# Altium project Power&Measurement_V2.PrjPcb
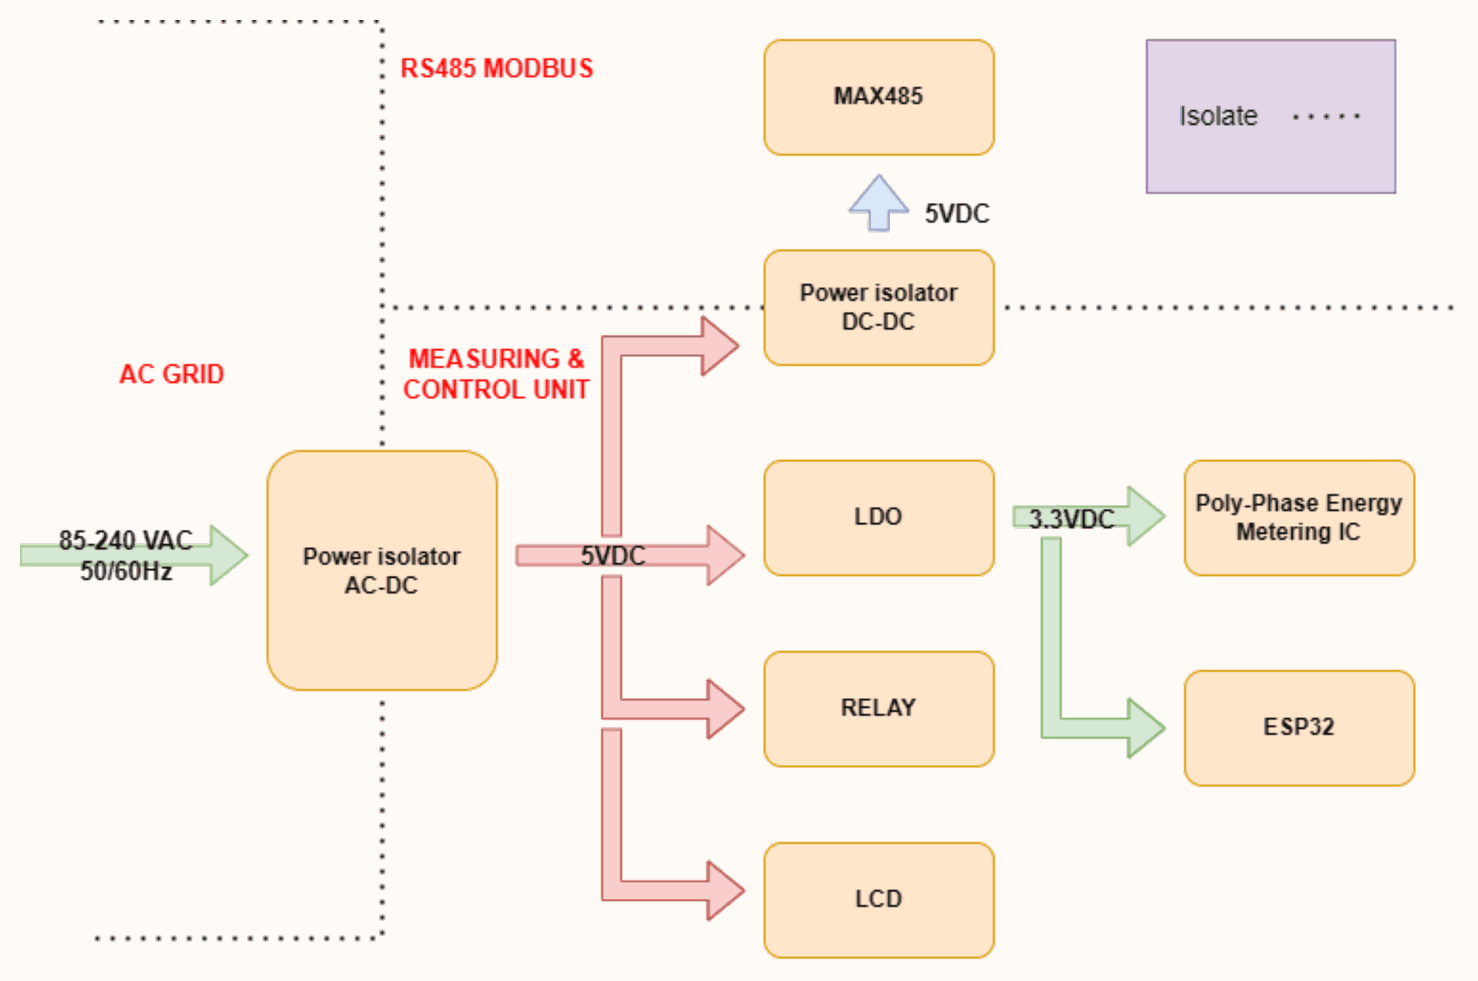
[diagram p0: Sheet1.SchDoc]
DrawnBy: Hoang Nhat; MasterProject: POWER METER V2; SubSystem: Power & Measurement
3 sheets, 128 parts. Net scope: flat (ports and power ports of the same name join across sheets).
Board file: PCB1.PcbDoc
Sheets:
  Sheet1.SchDoc
  Sheet2.SchDoc
  Sheet3.SchDoc

## Sheet Sheet1.SchDoc: Power Tree
size 420 x 297 mm; SheetNumber: 1; SheetTotal: 3

### Notes on the sheet
- Sub-system:
- Project:
- Design by:
- Sheet title:
- Sheet
- of
- Checked by:
- Approved by:
- Doc No:
- Revision:
- Size:
- Date:
- A3

## Sheet Sheet2.SchDoc: Power supply & Other function
size 420 x 297 mm; SheetNumber: 2; SheetTotal: 3
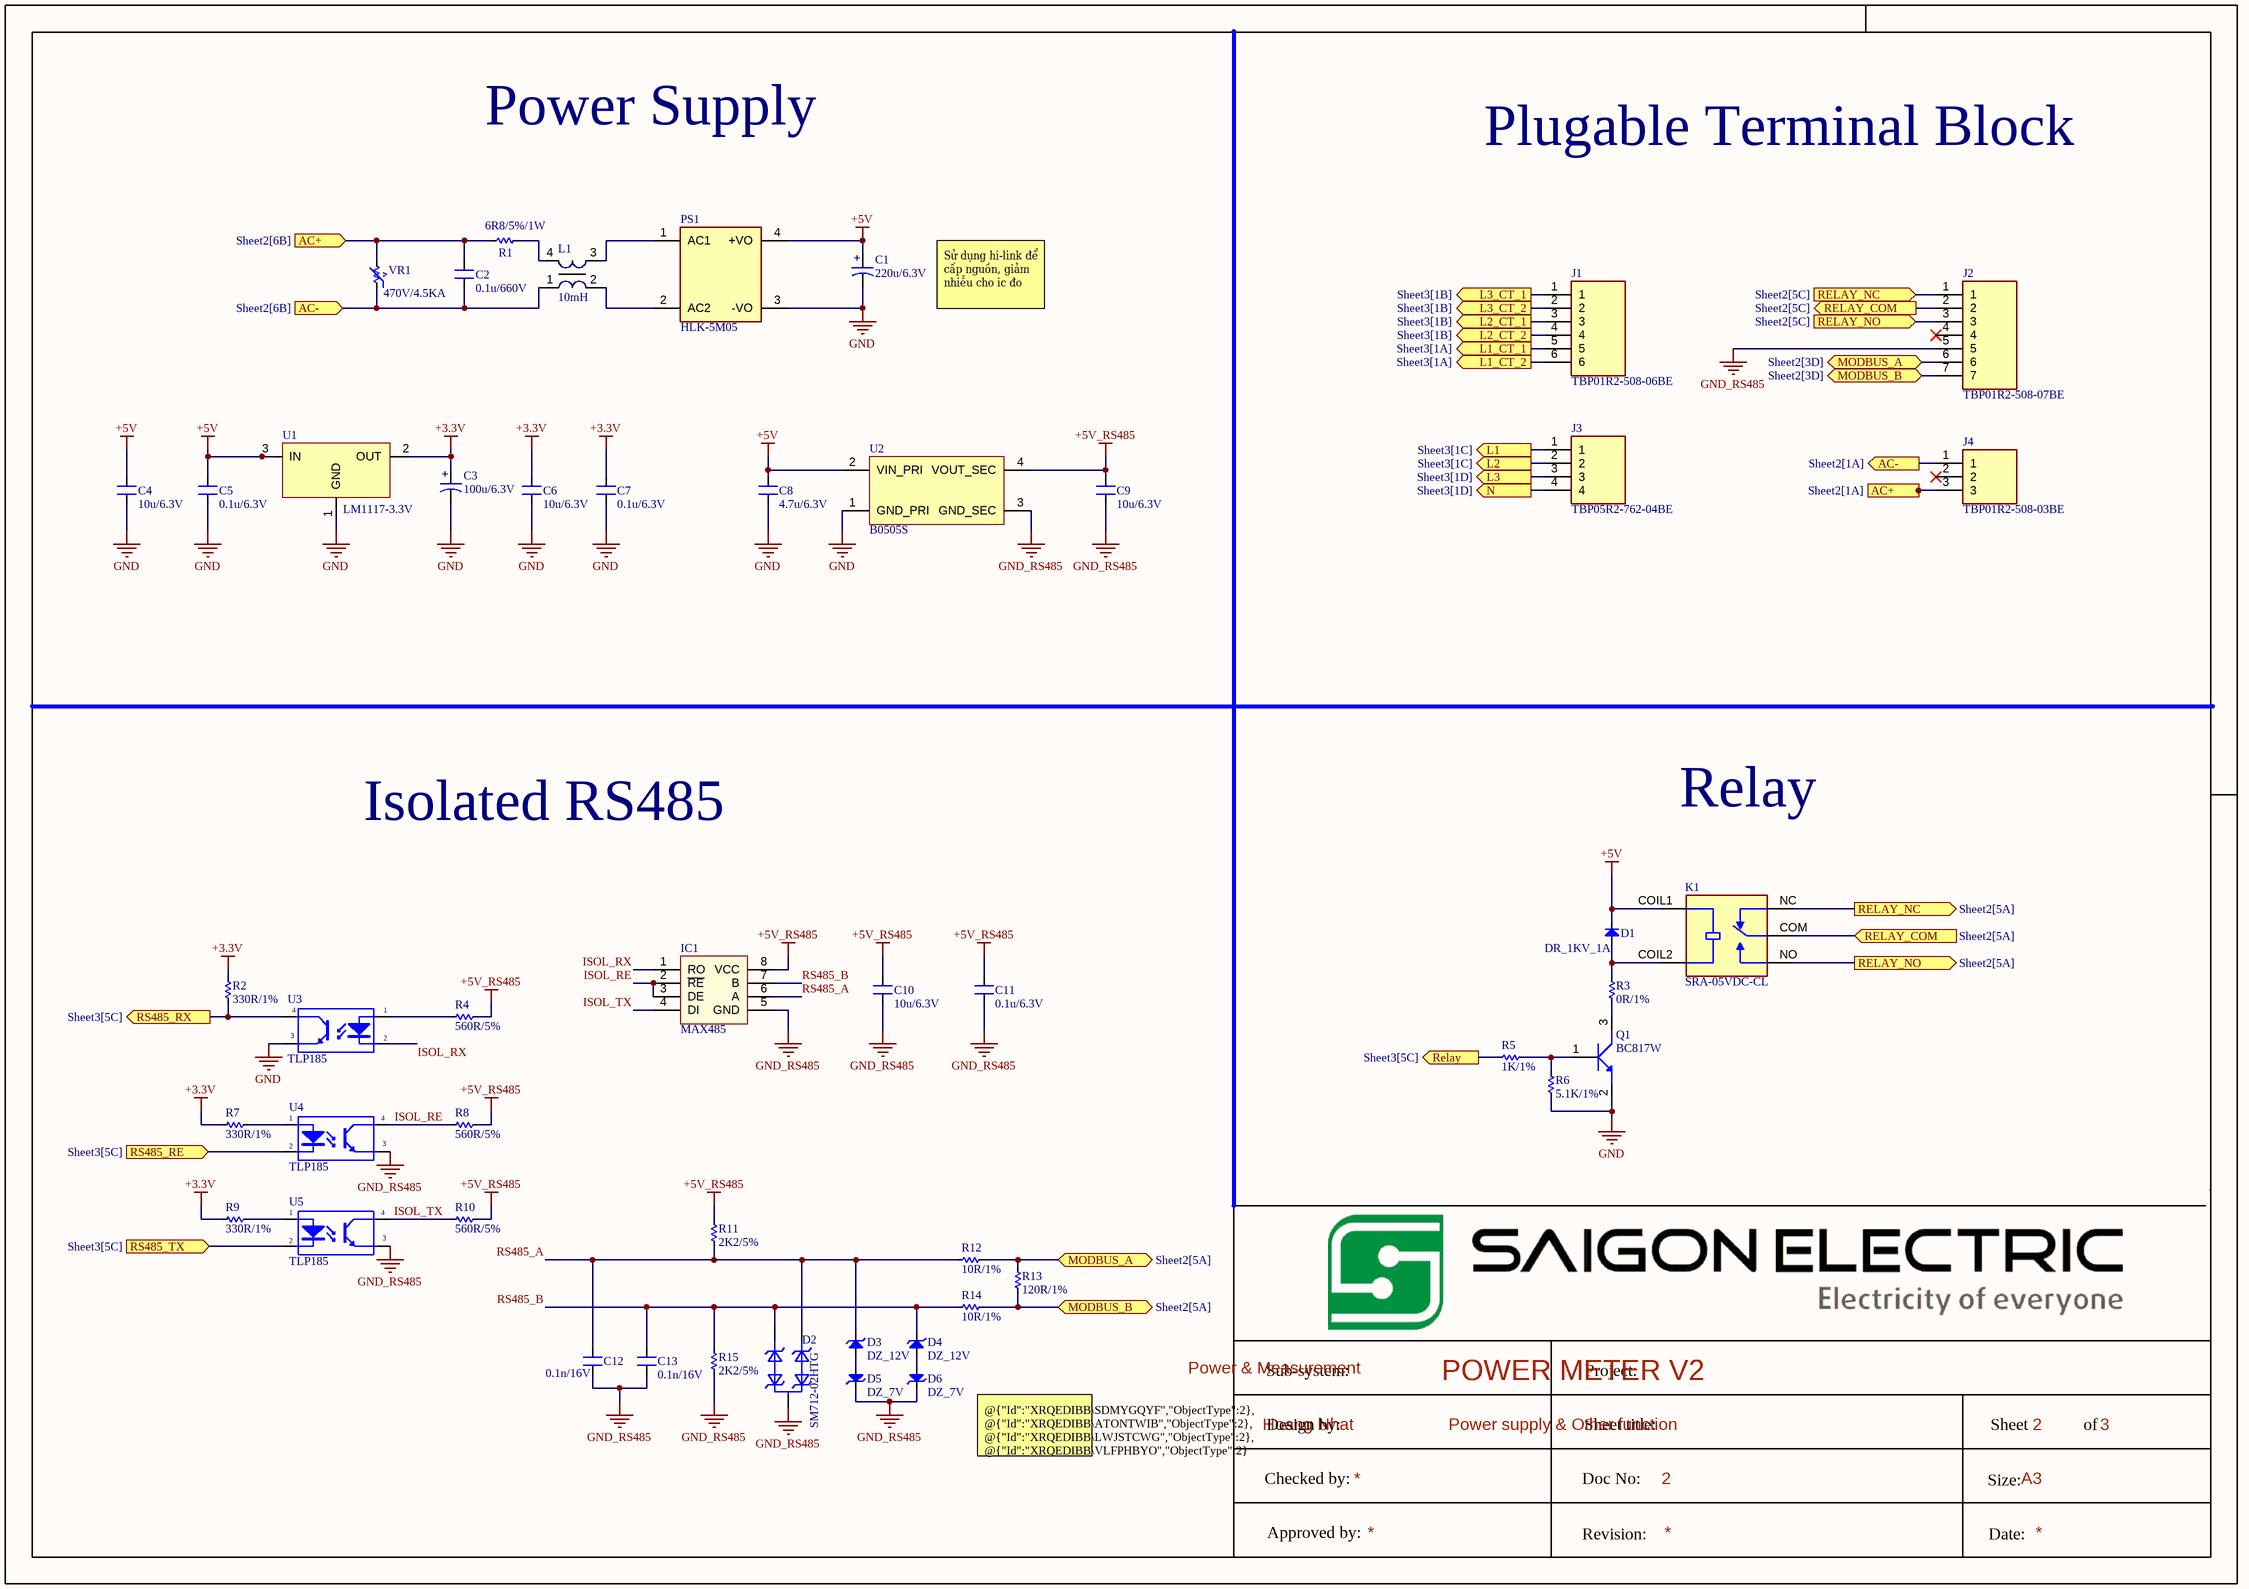
[diagram p1: Sheet2.SchDoc]

### Parts
C1  220u/6.3V  [CAP-ALU-SMD-6.3x7.7x2.2]
C2  0.1u/660V  [CAPRR1500W60L1750T900H1600]
C3  100u/6.3V  [CAP-ALU-SMD-6.3x7.7x2.2]
C4  10u/6.3V  [CAP_C_2012X110]
C5  0.1u/6.3V  [CAP_C_2012X110]
C6  10u/6.3V  [CAP_C_2012X110]
C7  0.1u/6.3V  [CAP_C_2012X110]
C8  4.7u/6.3V  [CAP_C_2012X110]
C9  10u/6.3V  [CAP_C_2012X110]
C10  10u/6.3V  [CAP_C_2012X110]
C11  0.1u/6.3V  [CAP_C_2012X110]
C12  0.1n/16V  [CAP_C_2012X110]
C13  0.1n/16V  [CAP_C_2012X110]
D1  DR_1KV_1A  [DIOM5025X26N]
D2  SM712-02HTG  [SOT95P237X112-3N]
D3  DZ_12V  [LL-34]
D4  DZ_12V  [LL-34]
D5  DZ_7V  [LL-34]
D6  DZ_7V  [LL-34]
IC1  MAX485  [SOIC-8]
J1  TBP01R2-508-06BE  [CUI_TBP01R2-508-06BE]
J2  TBP01R2-508-07BE  [CUI_TBP01R2-508-07BE]
J3  TBP05R2-762-04BE  [CUI_TBP05R2-762-04BE]
J4  TBP01R2-508-03BE  [CUI_TBP01R2-508-03BE]
K1  SRA-05VDC-CL  [RELAY_SRA-05VDC-CL]
L1  10mH  [UU98LFH142LF]
PS1  HLK-5M05  [CONV_HLK-5M05]
Q1  BC817W  [SOT-323]
R1  6R8/5%/1W  [RES-1W]
R2  330R/1%  [RES_C_2012X65]
R3  0R/1%  [RES_C_2012X65]
R4  560R/5%  [RES_C_2012X65]
R5  1K/1%  [RES_C_2012X65]
R6  5.1K/1%  [RES_C_2012X65]
R7  330R/1%  [RES_C_2012X65]
R8  560R/5%  [RES_C_2012X65]
R9  330R/1%  [RES_C_2012X65]
R10  560R/5%  [RES_C_2012X65]
R11  2K2/5%  [RES_C_2012X65]
R12  10R/1%  [RES_C_3216X70]
R13  120R/1%  [RES_C_3216X70]
R14  10R/1%  [RES_C_3216X70]
R15  2K2/5%  [RES_C_2012X65]
U1  LM1117-3.3V  [SOT230P700X180-4N]
U2  B0505S  [B0505S-1W]
U3  TLP185  [SOP254P700X220-4N]
U4  TLP185  [SOP254P700X220-4N]
U5  TLP185  [SOP254P700X220-4N]
VR1  470V/4.5KA  [B72214P2301K101]

### Ports
AC+ (in, see Sheet2[6B]), AC+ (out, see Sheet2[1A]), AC- (in, see Sheet2[6B]), AC- (out, see Sheet2[1A]), L1 (out, see Sheet3[1C]), L1_CT_1 (out, see Sheet3[1A]), L1_CT_2 (out, see Sheet3[1A]), L2 (out, see Sheet3[1C]), L2_CT_1 (out, see Sheet3[1B]), L2_CT_2 (out, see Sheet3[1B]), L3 (out, see Sheet3[1D]), L3_CT_1 (out, see Sheet3[1B]), L3_CT_2 (out, see Sheet3[1B]), MODBUS_A (bidir, see Sheet2[3D]), MODBUS_A (bidir, see Sheet2[5A]), MODBUS_B (bidir, see Sheet2[3D]), MODBUS_B (bidir, see Sheet2[5A]), N (out, see Sheet3[1D]), Relay (out, see Sheet3[5C]), RELAY_COM (in, see Sheet2[5A]), RELAY_COM (out, see Sheet2[5C]), RELAY_NC (in, see Sheet2[5C]), RELAY_NC (out, see Sheet2[5A]), RELAY_NO (in, see Sheet2[5C]), RELAY_NO (out, see Sheet2[5A]), RS485_RE (in, see Sheet3[5C]), RS485_RX (out, see Sheet3[5C]), RS485_TX (in, see Sheet3[5C])

### Nets
+3.3V: C3.1 C6.2 C7.2 R2.1 R7.1 R9.1 U1.2(OUT)
+5V: C1.1 C4.2 C5.2 C8.2 D1.2(K) K1.COIL1 PS1.4(+VO) U1.3(IN) U2.2(VIN_PRI)
+5V_RS485: C9.2 C10.2 C11.2 IC1.8(VCC) R4.2 R8.2 R10.2 R11.2 U2.4(VOUT_SEC)
GND: C1.2 C3.2 C4.1 C5.1 C6.1 C7.1 C8.1 PS1.3(-VO) Q1.2(E) R6.1 U1.1(GND) U2.1(GND_PRI) U3.3(E)
GND_RS485: C9.1 C10.1 C11.1 C12.1 C13.1 D2.3 D5.1(K) D6.1(K) IC1.5(GND) J2.5 R15.1 U2.3(GND_SEC) U4.3(E) U5.3(E)
ISOL_RE: IC1.2(~{RE}) IC1.3(DE) R8.1 U4.4(C)
ISOL_RX: IC1.1(RO) U3.2(K)
ISOL_TX: IC1.4(DI) R10.1 U5.4(C)
RS485_A: C12.2 D2.1 D3.1(K) IC1.6(A) R11.1 R12.1
RS485_B: C13.2 D2.2 D4.1(K) IC1.7(B) R14.1 R15.2
NetC2_1: C2.1 J4.1 L1.1 VR1.2 ; port AC-
NetC2_2: C2.2 J4.3 R1.1 VR1.1 ; port AC+
NetCT1_1: J1.6 ; port L1_CT_2
NetCT1_2: J1.5 ; port L1_CT_1
NetCT2_1: J1.4 ; port L2_CT_2
NetCT2_2: J1.3 ; port L2_CT_1
NetCT3_1: J1.2 ; port L3_CT_2
NetCT3_2: J1.1 ; port L3_CT_1
NetD1_1: D1.1(A) K1.COIL2 R3.2
NetD3_2: D3.2(A) D5.2(A)
NetD4_2: D4.2(A) D6.2(A)
NetF1_1: J3.4 ; port N
NetJ2_1: J2.1 K1.NC ; port RELAY_NC
NetJ2_2: J2.2 K1.COM ; port RELAY_COM
NetJ2_3: J2.3 K1.NO ; port RELAY_NO
NetJ2_6: J2.6 R12.2 R13.2 ; port MODBUS_A
NetJ2_7: J2.7 R13.1 R14.2 ; port MODBUS_B
NetJ3_1: J3.1 ; port L1
NetJ3_2: J3.2 ; port L2
NetJ3_3: J3.3 ; port L3
NetJ6_2: U5.2(K) ; port RS485_TX
NetJ6_4: U4.2(K) ; port RS485_RE
NetJ6_8: R2.2 U3.4(C) ; port RS485_RX
NetJ6_10: R5.1 ; port Relay
NetL1_2: L1.2 PS1.2(AC2)
NetL1_3: L1.3 PS1.1(AC1)
NetL1_4: L1.4 R1.2
NetQ1_1: Q1.1(B) R5.2 R6.2
NetQ1_3: Q1.3(C) R3.1
NetR4_1: R4.1 U3.1(A)
NetR7_2: R7.2 U4.1(A)
NetR9_2: R9.2 U5.1(A)

Not connected (* = marked no-connect by the designer): J2 4*; J4 2*

### Notes on the sheet
- Power Supply
- Plugable Terminal Block
- Sử dụng hi-link để cấp nguồn, giảm nhiễu cho ic đo
- Isolated RS485
- Relay
- @{"Id":"XRQEDIBB\SDMYGQYF","ObjectType":2}, @{"Id":"XRQEDIBB\ATONTWIB","ObjectType":2}, @{"Id":"XRQEDIBB\LWJSTCWG","ObjectType":2}, @{"Id":"XRQEDIBB\VLFPHBYO","ObjectType":2} placeholder LL-34 zener
- Sub-system:
- Project:
- Design by:
- Sheet title:
- Sheet
- of
- Checked by:
- Approved by:
- Doc No:
- Revision:
- Size:
- Date:
- A3
- (in symbol CAP_POLAR) +

### Library data of the parts
C1 C3 = CAP_POLAR
C2 C4-C13 = CAP_SMD
D1 = Diode: Default Diode; Code - JEDEC: DO-214-AB; Value: 1N5007; Published: 8-Jun-2000; Revision: July-2002: Re-released for DXP Platform.; Publisher: Altium Limited
D2 = SM712-02HTG: TVS Diode, SM712 Series, 31V Clamp, 600W Peak Pulse, Surface Mount, SOT23-3 | Littelfuse SM712-02HTG; MF: Littelfuse Inc.; SnapEDA_Link: https://www.snapeda.com/parts/SM712-02HTG/Littelfuse/view-part/?ref=snap; Package: SOT-23 Littelfuse Inc.; Value: *; MP: SM712-02HTG; Check_prices: https://www.snapeda.com/parts/SM712-02HTG/Littelfuse/view-part/?ref=eda
D3-D6 = DIODE Zener: Zenner
IC1 = MAX485: RS232 - RS485 (Same sn75176)
J1 = TBP01R2-508-06BE: 2~24 Ð¿Ð¾Ð»ÑŽÑÐ°, Ð¿Ð¾Ð´ÐºÐ»ÑŽÑ‡Ð°ÐµÐ¼Ñ‹Ð¹, Ð²ÐµÑ€Ñ‚Ð¸ÐºÐ°Ð»ÑŒÐ½Ñ‹Ð¹, ÑˆÐ°Ð³ 5,08, ÐºÐ»ÐµÐ¼Ð¼Ð½Ñ‹Ð¹ Ð±Ð»Ð¾Ðº; MF: Same Sky; SnapEDA_Link: https://www.snapeda.com/parts/TBP01R2-508-06BE/Same+Sky/view-part/?ref=snap; Package: None; Value: *; MP: TBP01R2-508-06BE; Check_prices: https://www.snapeda.com/parts/TBP01R2-508-06BE/Same+Sky/view-part/?ref=eda
J2 = TBP01R2-508-07BE: 2~24 Poles, Pluggable, Receptacle, Vertical, 5.08 Pitch, Terminal Block Connector; MF: Same Sky; SnapEDA_Link: https://www.snapeda.com/parts/TBP01R2-508-07BE/Same+Sky/view-part/?ref=snap; Package: None; Value: *; MP: TBP01R2-508-07BE; Check_prices: https://www.snapeda.com/parts/TBP01R2-508-07BE/Same+Sky/view-part/?ref=eda
J3 = TBP05R2-762-04BE: 2~24 Poles, Pluggable, Receptacle, Vertical, 7.62 Pitch, Terminal Block Connector; MF: Same Sky; SnapEDA_Link: https://www.snapeda.com/parts/TBP05R2-762-04BE/Same+Sky/view-part/?ref=snap; Package: None; Value: *; MP: TBP05R2-762-04BE; Check_prices: https://www.snapeda.com/parts/TBP05R2-762-04BE/Same+Sky/view-part/?ref=eda
J4 = TBP01R2-508-03BE: 2~24 Poles, Pluggable, Receptacle, Vertical, 5.08 Pitch, Terminal Block Connector; MF: Same Sky; SnapEDA_Link: https://www.snapeda.com/parts/TBP01R2-508-03BE/Same+Sky/view-part/?ref=snap; Package: None; Value: *; MP: TBP01R2-508-03BE; Check_prices: https://www.snapeda.com/parts/TBP01R2-508-03BE/Same+Sky/view-part/?ref=eda
K1 = SRA-05VDC-CL: MF: Songle Relay; SnapEDA_Link: https://www.snapeda.com/parts/SRA-05VDC-CL/Songle+Relay/view-part/?ref=snap; Package: Package; Value: *; MP: SRA-05VDC-CL; Check_prices: https://www.snapeda.com/parts/SRA-05VDC-CL/Songle+Relay/view-part/?ref=eda
L1 = L-DIP-2: partNo: 744284100; Manufacturer: Würth Elektronik eiSos GmbH; Inductance: 10mH; ComponentLink1Description: Manufacturer; ComponentLink1URL: http://www.we-online.de; Created by: Christin Zierenner; Created Date: March 2012; ComponentLink2Description: Datasheet; ComponentLink2URL: http://www.we-online.de/katalog/media/pdf/744284100.pdf
PS1 = HLK-5M05: AC DC 220V to 5V 5W 5Watt Isolated Switching Step-Down Power Supply Module Converter; MF: Hi-link; Check_prices: https://www.snapeda.com/parts/HLK-5M05/Hi-link/view-part/?ref=eda; SnapEDA_Link: https://www.snapeda.com/parts/HLK-5M05/Hi-link/view-part/?ref=snap; Price: None; Availability: Not in stock; Package: Package; MP: HLK-5M05; Value: *
Q1 = BJT_NPN: LCSC Part #: *
R1-R15 = Res-SMD: Resistor; Manufacturer: Generic Components; Class: Passive; Published: 08/06/2000; Publisher: Altium Hobart Technology Centre
U1 = LM1117: 800mA Low-Dropout Linear Regulator; Creator: Nguyen Ba Bien; Website: http://group3i.net
U3-U5 = TLP185: Single Opto; Value: PC817
VR1 = Varistor: MOV-14D471K, Varistors 470V 14mm
U2 = B0505S: LCSC Part #: *

## Sheet Sheet3.SchDoc: Poly Phase Metering
size 420 x 297 mm; SheetNumber: 3; SheetTotal: 3
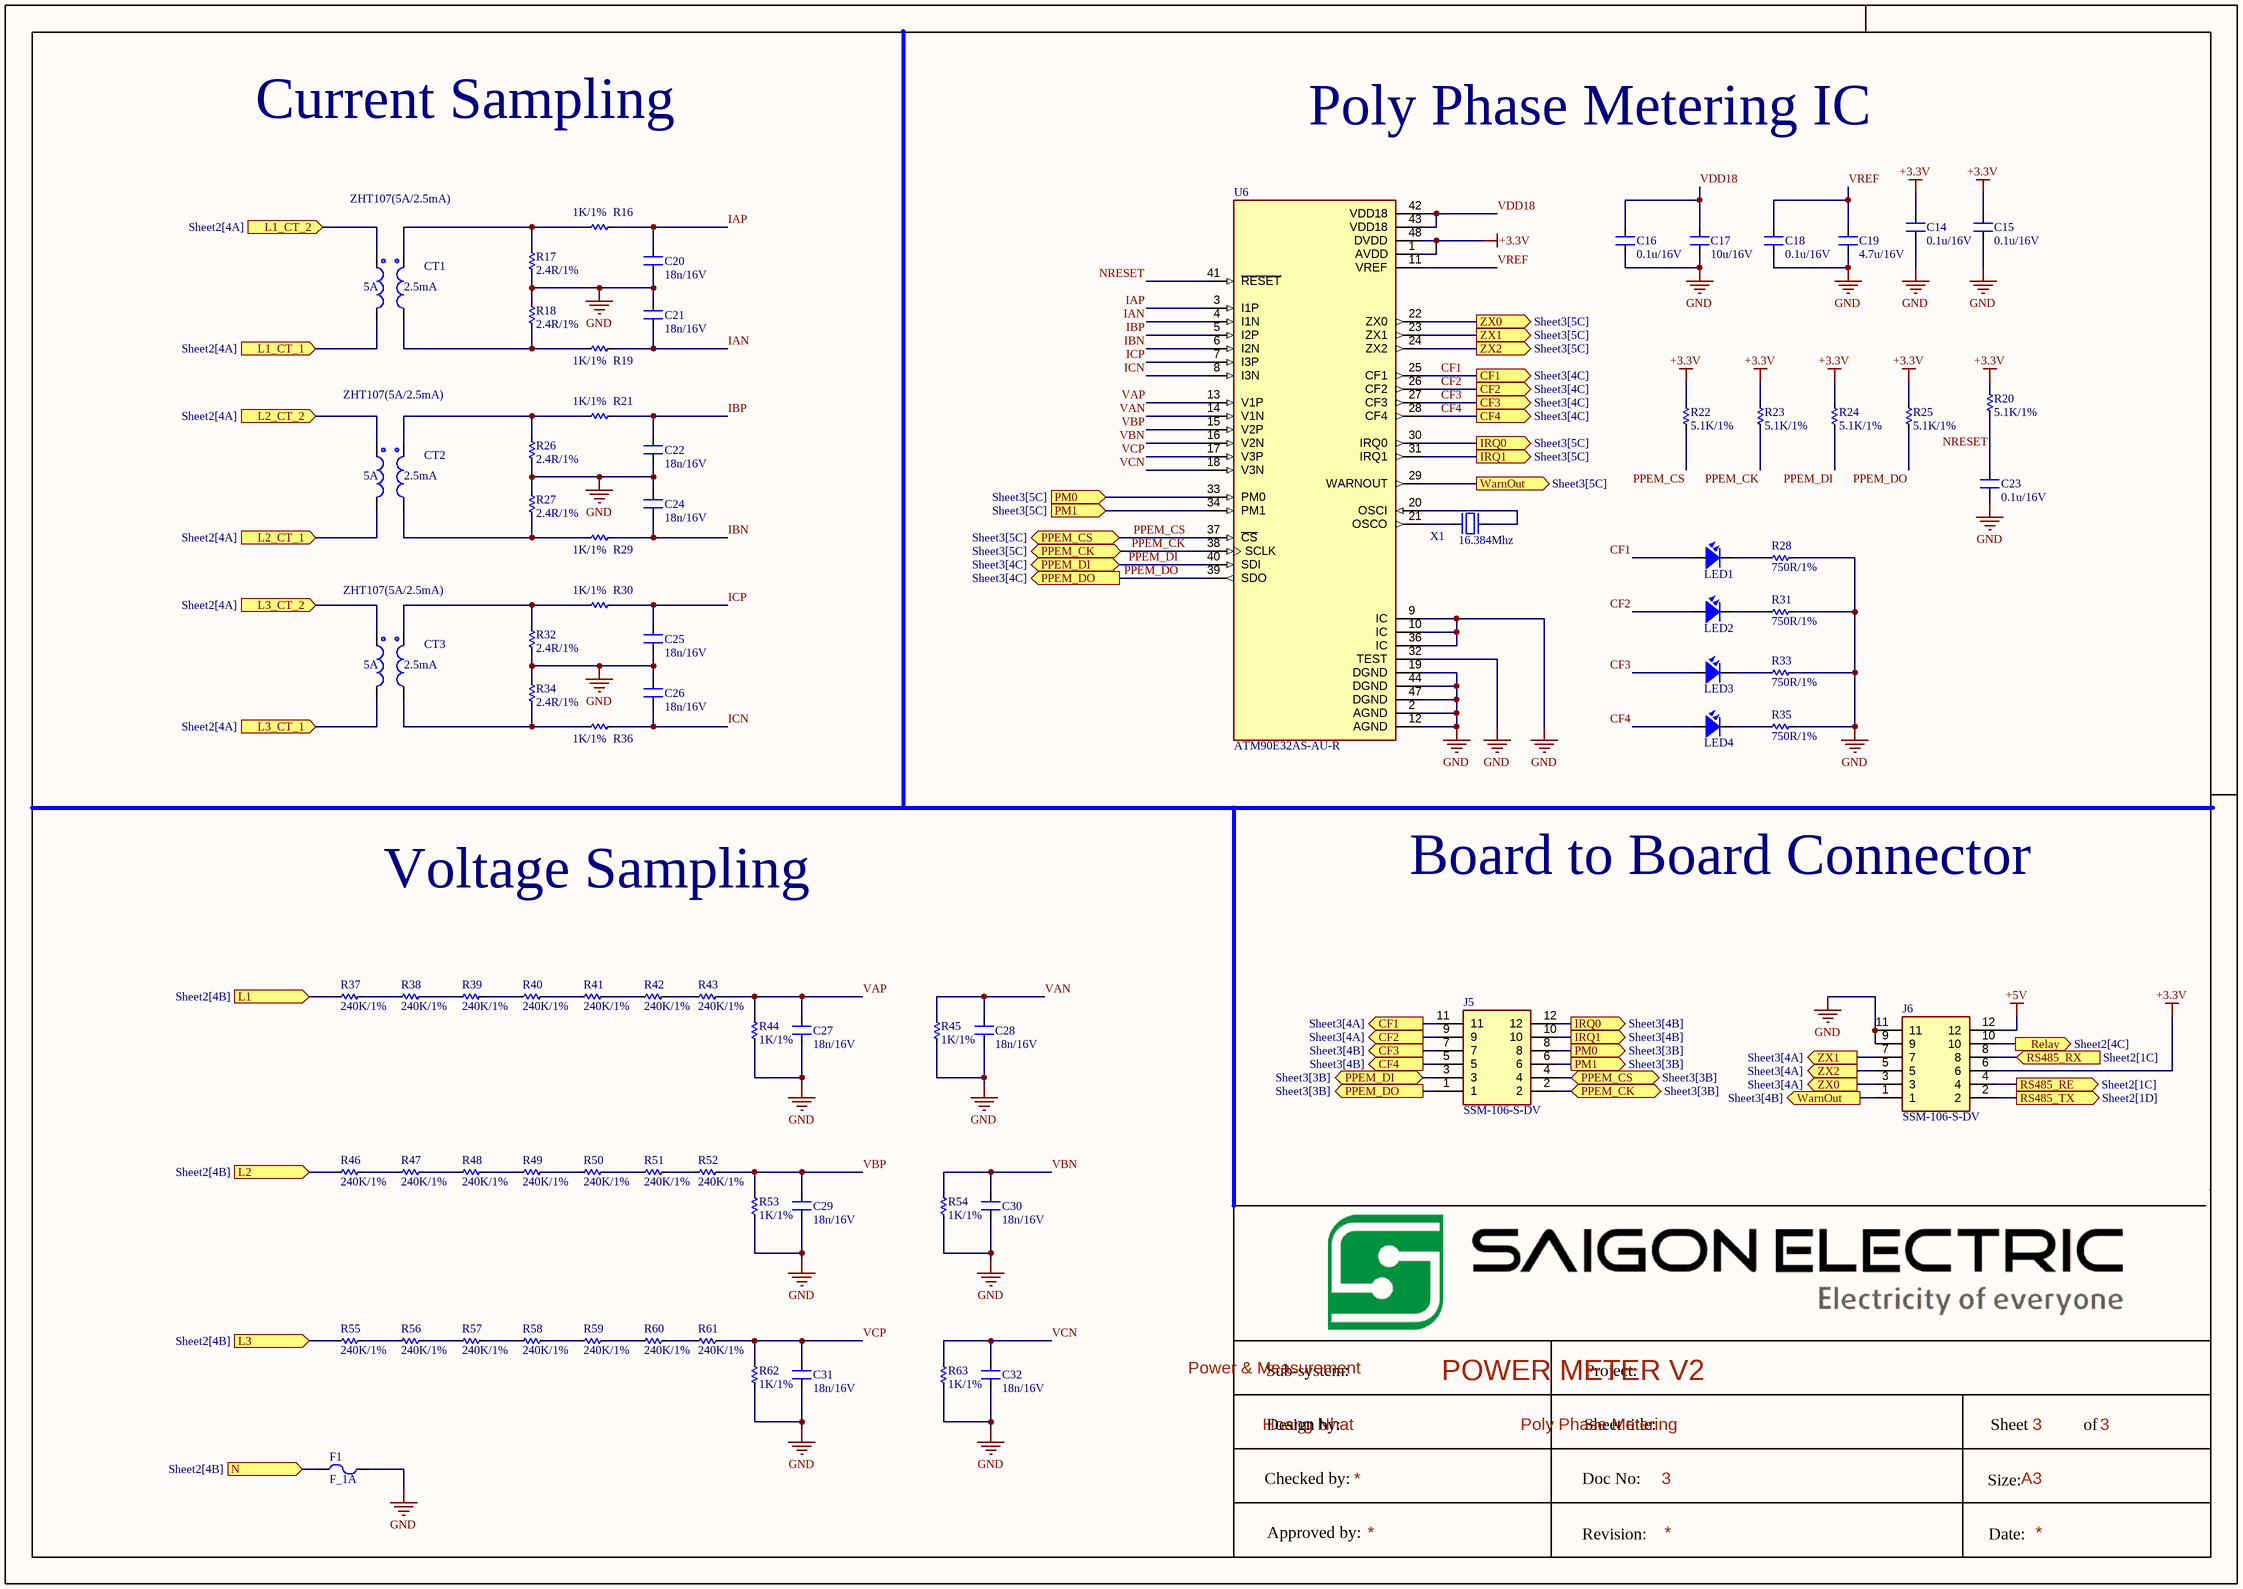
[diagram p2: Sheet3.SchDoc]

### Parts
C14  0.1u/16V  [CAP_C_2012X110]
C15  0.1u/16V  [CAP_C_2012X110]
C16  0.1u/16V  [CAP_C_2012X110]
C17  10u/16V  [CAP_C_2012X110]
C18  0.1u/16V  [CAP_C_2012X110]
C19  4.7u/16V  [CAP_C_2012X110]
C20  18n/16V  [CAP_C_2012X110]
C21  18n/16V  [CAP_C_2012X110]
C22  18n/16V  [CAP_C_2012X110]
C23  0.1u/16V  [CAP_C_2012X110]
C24  18n/16V  [CAP_C_2012X110]
C25  18n/16V  [CAP_C_2012X110]
C26  18n/16V  [CAP_C_2012X110]
C27  18n/16V  [CAP_C_2012X110]
C28  18n/16V  [CAP_C_2012X110]
C29  18n/16V  [CAP_C_2012X110]
C30  18n/16V  [CAP_C_2012X110]
C31  18n/16V  [CAP_C_2012X110]
C32  18n/16V  [CAP_C_2012X110]
CT1  ZHT107(5A/2.5mA)  [ZHT107]
CT2  ZHT107(5A/2.5mA)  [ZHT107]
CT3  ZHT107(5A/2.5mA)  [ZHT107]
F1  F_1A  [FUSC6127X294N]
J5  SSM-106-S-DV  [SSM-106-XXX-DV-BE]
J6  SSM-106-S-DV  [SSM-106-XXX-DV-BE]
LED1  LED  [LED-0805-Blue]  (value not drawn)
LED2  LED  [LED-0805-Blue]  (value not drawn)
LED3  LED  [LED-0805-Blue]  (value not drawn)
LED4  LED  [LED-0805-Blue]  (value not drawn)
R16  1K/1%  [RES_C_2012X65]
R17  2.4R/1%  [RES_C_2012X65]
R18  2.4R/1%  [RES_C_2012X65]
R19  1K/1%  [RES_C_2012X65]
R20  5.1K/1%  [RES_C_2012X65]
R21  1K/1%  [RES_C_2012X65]
R22  5.1K/1%  [RES_C_2012X65]
R23  5.1K/1%  [RES_C_2012X65]
R24  5.1K/1%  [RES_C_2012X65]
R25  5.1K/1%  [RES_C_2012X65]
R26  2.4R/1%  [RES_C_2012X65]
R27  2.4R/1%  [RES_C_2012X65]
R28  750R/1%  [RES_C_2012X65]
R29  1K/1%  [RES_C_2012X65]
R30  1K/1%  [RES_C_2012X65]
R31  750R/1%  [RES_C_2012X65]
R32  2.4R/1%  [RES_C_2012X65]
R33  750R/1%  [RES_C_2012X65]
R34  2.4R/1%  [RES_C_2012X65]
R35  750R/1%  [RES_C_2012X65]
R36  1K/1%  [RES_C_2012X65]
R37  240K/1%  [RES_C_2012X65]
R38  240K/1%  [RES_C_2012X65]
R39  240K/1%  [RES_C_2012X65]
R40  240K/1%  [RES_C_2012X65]
R41  240K/1%  [RES_C_2012X65]
R42  240K/1%  [RES_C_2012X65]
R43  240K/1%  [RES_C_2012X65]
R44  1K/1%  [RES_C_2012X65]
R45  1K/1%  [RES_C_2012X65]
R46  240K/1%  [RES_C_2012X65]
R47  240K/1%  [RES_C_2012X65]
R48  240K/1%  [RES_C_2012X65]
R49  240K/1%  [RES_C_2012X65]
R50  240K/1%  [RES_C_2012X65]
R51  240K/1%  [RES_C_2012X65]
R52  240K/1%  [RES_C_2012X65]
R53  1K/1%  [RES_C_2012X65]
R54  1K/1%  [RES_C_2012X65]
R55  240K/1%  [RES_C_2012X65]
R56  240K/1%  [RES_C_2012X65]
R57  240K/1%  [RES_C_2012X65]
R58  240K/1%  [RES_C_2012X65]
R59  240K/1%  [RES_C_2012X65]
R60  240K/1%  [RES_C_2012X65]
R61  240K/1%  [RES_C_2012X65]
R62  1K/1%  [RES_C_2012X65]
R63  1K/1%  [RES_C_2012X65]
U6  ATM90E32AS-AU-R  [TSQFP50P900X900X120-48N]
X1  16.384Mhz  [XT2-SMD]

### Ports
CF1 (out, see Sheet3[4A]), CF1 (out, see Sheet3[4C]), CF2 (out, see Sheet3[4A]), CF2 (out, see Sheet3[4C]), CF3 (out, see Sheet3[4B]), CF3 (out, see Sheet3[4C]), CF4 (out, see Sheet3[4B]), CF4 (out, see Sheet3[4C]), IRQ0 (out, see Sheet3[4B]), IRQ0 (out, see Sheet3[5C]), IRQ1 (out, see Sheet3[4B]), IRQ1 (out, see Sheet3[5C]), L1 (in, see Sheet2[4B]), L1_CT_1 (in, see Sheet2[4A]), L1_CT_2 (in, see Sheet2[4A]), L2 (in, see Sheet2[4B]), L2_CT_1 (in, see Sheet2[4A]), L2_CT_2 (in, see Sheet2[4A]), L3 (in, see Sheet2[4B]), L3_CT_1 (in, see Sheet2[4A]), L3_CT_2 (in, see Sheet2[4A]), N (in, see Sheet2[4B]), PM0 (in, see Sheet3[5C]), PM0 (out, see Sheet3[3B]), PM1 (in, see Sheet3[5C]), PM1 (out, see Sheet3[3B]), PPEM_CK (bidir, see Sheet3[3B]), PPEM_CK (bidir, see Sheet3[5C]), PPEM_CS (bidir, see Sheet3[3B]), PPEM_CS (bidir, see Sheet3[5C]), PPEM_DI (bidir, see Sheet3[3B]), PPEM_DI (bidir, see Sheet3[4C]), PPEM_DO (out, see Sheet3[3B]), PPEM_DO (out, see Sheet3[4C]), Relay (out, see Sheet2[4C]), RS485_RE (out, see Sheet2[1C]), RS485_RX (in, see Sheet2[1C]), RS485_TX (out, see Sheet2[1D]), WarnOut (out, see Sheet3[4B]), WarnOut (out, see Sheet3[5C]), ZX0 (out, see Sheet3[4A]), ZX0 (out, see Sheet3[5C]), ZX1 (out, see Sheet3[4A]), ZX1 (out, see Sheet3[5C]), ZX2 (out, see Sheet3[4A]), ZX2 (out, see Sheet3[5C])

### Nets
+3.3V: C14.2 C15.2 J6.6 R20.2 R22.2 R23.2 R24.2 R25.2 U6.1(AVDD) U6.48(DVDD)
+5V: J6.12
GND: C14.1 C15.1 C16.1 C17.1 C18.1 C19.1 C20.1 C21.2 C22.1 C23.1 C24.2 C25.1 C26.2 C27.1 C28.1 C29.1 C30.1 C31.1 C32.1 F1.2 J6.9 J6.11 R17.2 R18.1 R26.2 R27.1 R28.2 R31.2 R32.2 R33.2 R34.1 R35.2 R44.2 R45.2 R53.2 R54.2 R62.2 R63.2 U6.2(AGND) U6.9(IC) U6.10(IC) U6.12(AGND) U6.19(DGND) U6.32(TEST) U6.36(IC) U6.44(DGND) U6.47(DGND)
CF1: J5.11 LED1.1 U6.25(CF1) ; port CF1
CF2: J5.9 LED2.1 U6.26(CF2) ; port CF2
CF3: J5.7 LED3.1 U6.27(CF3) ; port CF3
CF4: J5.5 LED4.1 U6.28(CF4) ; port CF4
IAN: C21.1 R19.2 U6.4(I1N)
IAP: C20.2 R16.2 U6.3(I1P)
IBN: C24.1 R29.2 U6.6(I2N)
IBP: C22.2 R21.2 U6.5(I2P)
ICN: C26.1 R36.2 U6.8(I3N)
ICP: C25.2 R30.2 U6.7(I3P)
NRESET: C23.2 R20.1 U6.41(~{RESET})
PPEM_CK: J5.2 R23.1 U6.38(SCLK) ; port PPEM_CK
PPEM_CS: J5.4 R22.1 U6.37(~{CS}) ; port PPEM_CS
PPEM_DI: J5.3 R24.1 U6.40(SDI) ; port PPEM_DI
PPEM_DO: J5.1 R25.1 U6.39(SDO) ; port PPEM_DO
VAN: C28.2 R45.1 U6.14(V1N)
VAP: C27.2 R43.1 R44.1 U6.13(V1P)
VBN: C30.2 R54.1 U6.16(V2N)
VBP: C29.2 R52.1 R53.1 U6.15(V2P)
VCN: C32.2 R63.1 U6.18(V3N)
VCP: C31.2 R61.1 R62.1 U6.17(V3P)
VDD18: C16.2 C17.2 U6.42(VDD18) U6.43(VDD18)
VREF: C18.2 C19.2 U6.11(VREF)
NetCT1_1: CT1.1 ; port L1_CT_2
NetCT1_2: CT1.2 ; port L1_CT_1
NetCT1_3: CT1.3 R16.1 R17.1
NetCT1_4: CT1.4 R18.2 R19.1
NetCT2_1: CT2.1 ; port L2_CT_2
NetCT2_2: CT2.2 ; port L2_CT_1
NetCT2_3: CT2.3 R21.1 R26.1
NetCT2_4: CT2.4 R27.2 R29.1
NetCT3_1: CT3.1 ; port L3_CT_2
NetCT3_2: CT3.2 ; port L3_CT_1
NetCT3_3: CT3.3 R30.1 R32.1
NetCT3_4: CT3.4 R34.2 R36.1
NetF1_1: F1.1 ; port N
NetJ3_1: R37.2 ; port L1
NetJ3_2: R46.2 ; port L2
NetJ3_3: R55.2 ; port L3
NetJ5_6: J5.6 U6.34(PM1) ; port PM1
NetJ5_8: J5.8 U6.33(PM0) ; port PM0
NetJ5_10: J5.10 U6.31(IRQ1) ; port IRQ1
NetJ5_12: J5.12 U6.30(IRQ0) ; port IRQ0
NetJ6_1: J6.1 U6.29(WARNOUT) ; port WarnOut
NetJ6_2: J6.2 ; port RS485_TX
NetJ6_3: J6.3 U6.22(ZX0) ; port ZX0
NetJ6_4: J6.4 ; port RS485_RE
NetJ6_5: J6.5 U6.24(ZX2) ; port ZX2
NetJ6_7: J6.7 U6.23(ZX1) ; port ZX1
NetJ6_8: J6.8 ; port RS485_RX
NetJ6_10: J6.10 ; port Relay
NetLED1_2: LED1.2 R28.1
NetLED2_2: LED2.2 R31.1
NetLED3_2: LED3.2 R33.1
NetLED4_2: LED4.2 R35.1
NetR37_1: R37.1 R38.2
NetR38_1: R38.1 R39.2
NetR39_1: R39.1 R40.2
NetR40_1: R40.1 R41.2
NetR41_1: R41.1 R42.2
NetR42_1: R42.1 R43.2
NetR46_1: R46.1 R47.2
NetR47_1: R47.1 R48.2
NetR48_1: R48.1 R49.2
NetR49_1: R49.1 R50.2
NetR50_1: R50.1 R51.2
NetR51_1: R51.1 R52.2
NetR55_1: R55.1 R56.2
NetR56_1: R56.1 R57.2
NetR57_1: R57.1 R58.2
NetR58_1: R58.1 R59.2
NetR59_1: R59.1 R60.2
NetR60_1: R60.1 R61.2
NetU6_20: U6.20(OSCI) X1.1
NetU6_21: U6.21(OSCO) X1.2

### Notes on the sheet
- Current Sampling
- Poly Phase Metering IC
- Voltage Sampling
- Board to Board Connector
- Sub-system:
- Project:
- Design by:
- Sheet title:
- Sheet
- of
- Checked by:
- Approved by:
- Doc No:
- Revision:
- Size:
- Date:
- A3
- (in symbol ZHT-107) 5A; 2.5mA

### Library data of the parts
C14-C32 = CAP_SMD
CT1-CT3 = ZHT-107: C5183046
F1 = Fuse: Designed by: VanDungEvn; Value: Fuse
J5 J6 = SSM-106-S-DV: Connector; Manufacturer_Name: SAMTEC; Manufacturer_Part_Number: SSM-105-S-DV; Datasheet Link: https://mm.digikey.com/Volume0/opasdata/d220001/medias/docus/6129/ssm-1xx-xxx-dv-xx-xx-xxx-x-xx-mkt.pdf; Mouser Part Number: 200-SSM105SDV; Mouser Price/Stock: https://www.mouser.co.uk/ProductDetail/Samtec/SSM-105-S-DV?qs=XtX6y9BSeMiNY1vJI%2FFCQQ%3D%3D; Arrow Part Number: SSM-105-S-DV; Arrow Price/Stock: https://www.arrow.com/en/products/ssm-105-s-dv/samtec; LCSC Part #: *
LED1-LED4 = LED SMD: Value: LED 3 - 5 ly 2 Colour
R16-R63 = Res-SMD: as R1 on sheet Sheet2; Published: 08/06/2000; Publisher: Altium Hobart Technology Centre
U6 = ATM90E32AS-AU-R: IC ENERGY METER 1.8V/3V 48TQFP; MF: Microchip; SnapEDA_Link: https://www.snapeda.com/parts/ATM90E32AS-AU-R/Microchip/view-part/592639/?ref=snap; MP: ATM90E32AS-AU-R; Availability: Warning; Price: None; Value: *; Purchase-URL: https://pricing.snapeda.com/search/part/ATM90E32AS-AU-R/?ref=eda; Package: TQFP-48 Microchip
X1 = XT2: Crystal, 32.768 KHz, -40 to 85 degC, 3.2 x 1.5 x 0.9 mm SMD; Value: 4Mhz

## Nets that join several sheets
+3.3V: Sheet2 (7 pins), Sheet3 (10 pins)
+5V: Sheet2 (9 pins), Sheet3 (J6.12)
GND: Sheet2 (13 pins), Sheet3 (47 pins)
NetCT1_1: Sheet2 (J1.6), Sheet3 (CT1.1)
NetCT1_2: Sheet2 (J1.5), Sheet3 (CT1.2)
NetCT2_1: Sheet2 (J1.4), Sheet3 (CT2.1)
NetCT2_2: Sheet2 (J1.3), Sheet3 (CT2.2)
NetCT3_1: Sheet2 (J1.2), Sheet3 (CT3.1)
NetCT3_2: Sheet2 (J1.1), Sheet3 (CT3.2)
NetF1_1: Sheet2 (J3.4), Sheet3 (F1.1)
NetJ3_1: Sheet2 (J3.1), Sheet3 (R37.2)
NetJ3_2: Sheet2 (J3.2), Sheet3 (R46.2)
NetJ3_3: Sheet2 (J3.3), Sheet3 (R55.2)
NetJ6_2: Sheet2 (U5.2), Sheet3 (J6.2)
NetJ6_4: Sheet2 (U4.2), Sheet3 (J6.4)
NetJ6_8: Sheet2 (R2.2 U3.4), Sheet3 (J6.8)
NetJ6_10: Sheet2 (R5.1), Sheet3 (J6.10)